# EAGLE design SwitchDemoFeather (EAGLE 9.1.3)
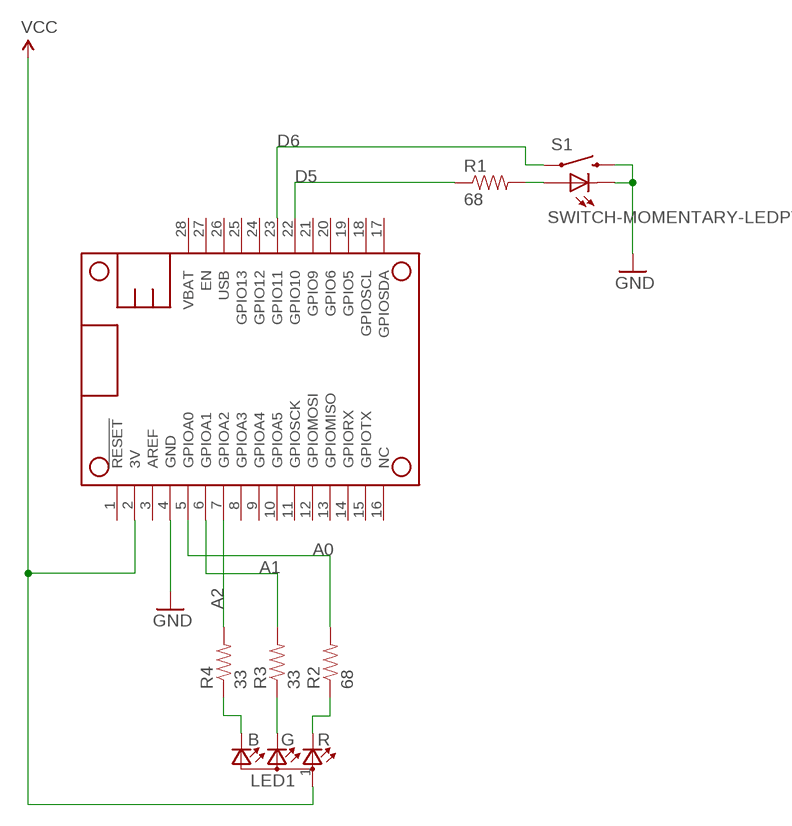
[diagram p0: schematic, sheet 1]

## Parts
LED1  LED-RGB-CREE-SMD  [LED-RGB-CREE-SMD]
MS1  FEATHERWING  [FEATHERWING]
R1  68  RES-68-0603.DEV  [0603-RES]
R2  68  RES-68-0603.DEV  [0603-RES]
R3  33  RES-33-0603.DEV  [0603-RES]
R4  33  RES-33-0603.DEV  [0603-RES]
S1  SWITCH-MOMENTARY-LEDPTH  [TACTILE-PTH-LED-12MM]

## Nets
A0: MS1.5(GPIOA0) R2.2
A1: MS1.6(GPIOA1) R3.2
A2: MS1.7(GPIOA2) R4.2
D5: MS1.22(GPIO10) R1.1
D6: MS1.23(GPIO11) S1.4
GND: MS1.4(GND) S1.2 S1.C
N$1: LED1.3(G) R3.1
N$2: LED1.2(B) R4.1
N$3: R1.2 S1.A
N$4: LED1.4(R) R2.1
VCC: LED1.1(A) MS1.2(3V)
Unconnected: MS1.1(!RESET) MS1.3(AREF) MS1.8(GPIOA3) MS1.9(GPIOA4) MS1.10(GPIOA5) MS1.11(GPIOSCK) MS1.12(GPIOMOSI) MS1.13(GPIOMISO) MS1.14(GPIORX) MS1.15(GPIOTX) MS1.16(NC) MS1.17(GPIOSDA) MS1.18(GPIOSCL) MS1.19(GPIO5) MS1.20(GPIO6) MS1.21(GPIO9) MS1.24(GPIO12) MS1.25(GPIO13) MS1.26(USB) MS1.27(EN) MS1.28(VBAT)

## Library data of the parts
LED1 = rickk2:LED-RGB-CREE-SMD: LED RGB DIFFUSED 4SMD $ 0.35 Cree CLMVB-FKA-CFHEHLCBB7A363 2mm 4-PLCC common anode RGB LED https://www.digikey.com/product-detail/en/cree-inc/CLMVB-FKA-CFHEHLCBB7A363/CLMVB-FKA-CFHEHLCBB7A363CT-ND/6138627 Red=68 ohm, Green/Blue=33 ohm @ 3.3V
MS1 = microbuilder:FEATHERWING
R1 R2 = rickk2:RES-68-0603.DEV: https://www.digikey.com/product-detail/en/panasonic-electronic-components/ERJ-3EKF68R0V/P68.0HCT-ND/1746805 Panasonic SMD 0603 1% 1/10W
R3 R4 = rickk2:RES-33-0603.DEV: https://www.digikey.com/product-detail/en/panasonic-electronic-components/ERJ-3EKF33R0V/P33.0HCT-ND/1746765 Panasonic SMD 0603 1% 1/10W
S1 = SparkFun-Electromechanical:SWITCH-MOMENTARY-LED: EZ is for Kits. There is no tStop (covering up the top side of the pads with mask). This helps the beginner see which side they should be soldering too.

## Board
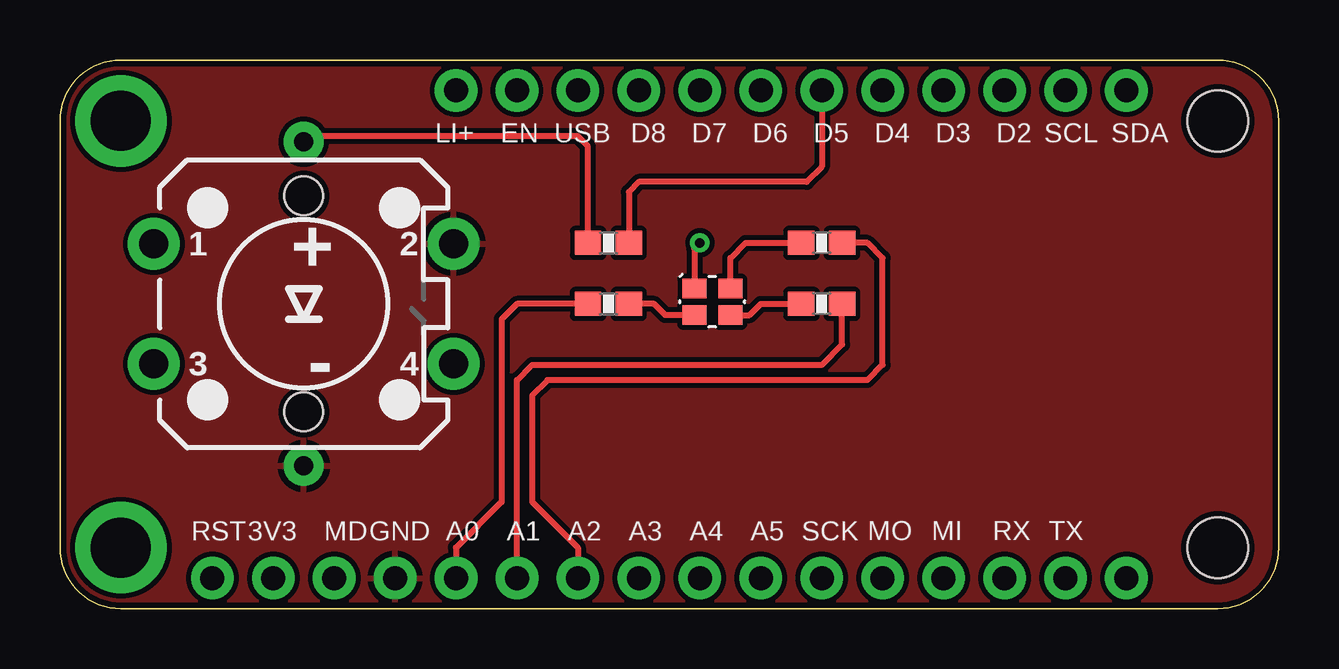
[diagram p1: board, top side]
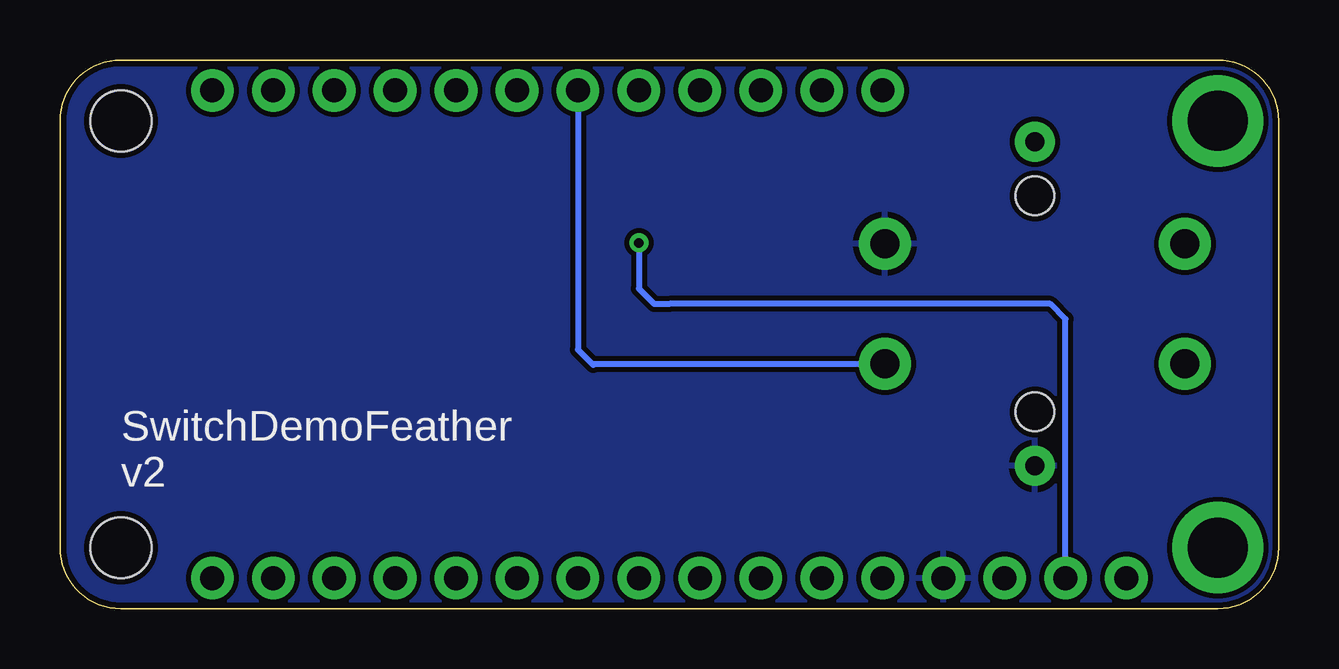
[diagram p2: board, bottom side, seen from below]

Size 50.8 x 22.86 mm. Coordinates in mm from the lower left corner, seen from the top.
Outline: 2.54,22.86 48.26,22.86 arc-90 50.8,20.32 50.8,2.54 arc-90 48.26,0 2.54,0 arc-90 0,2.54 0,20.32 arc-90 2.54,22.86
Copper layers (1*16): Top 0.035mm / dielectric 1.5mm / Bottom 0.035mm
Design rules "adafruit": minimum track width 8mil, minimum drill 15.5mil, track to track 8mil, track to pad 8mil, pad to pad 8mil, via to via 8mil, smd to smd 8mil, copper to edge 10mil, drill to drill 8mil, minimum pad ring 10mil, minimum via ring 8mil, stop-mask expansion 2mil, vias tented up to drill 20mil, thermal gap 10mil

### Footprints (pad centres in the part's own frame; a part is rotated, then mirrored left to right if it is on the bottom)
LED-RGB-CREE-SMD = smd 1 x 0.8: 1 1.5,0; 2 0,0; 3 0,1.1; 4 1.5,1.1
FEATHERWING = drill 1 pad 1.778: 1 6.35,1.27; 2 8.89,1.27; 3 11.43,1.27; 4 13.97,1.27; 5 16.51,1.27; 6 19.05,1.27; 7 21.59,1.27; 8 24.13,1.27; 9 26.67,1.27; 10 29.21,1.27; 11 31.75,1.27; 12 34.29,1.27; 13 36.83,1.27; 14 39.37,1.27; 15 41.91,1.27; 16 44.45,1.27; 17 44.45,21.59; 18 41.91,21.59; 19 39.37,21.59; 20 36.83,21.59; 21 34.29,21.59; 22 31.75,21.59; 23 29.21,21.59; 24 26.67,21.59; 25 24.13,21.59; 26 21.59,21.59; 27 19.05,21.59; 28 16.51,21.59 | drill 2.5 pad 3.81: P$1 2.54,20.32; P$2 2.54,2.54 | hole 2.54: 48.26,20.32; 48.26,2.54
0603-RES = smd 1.1 x 1: 1 -0.85,0; 2 0.85,0
TACTILE-PTH-LED-12MM = drill 1.2 pad 2.159: 1 -6.25,2.5; 2 6.25,2.5; 3 -6.25,-2.5; 4 6.25,-2.5 | drill 0.8 pad 1.676: A 0,6.75; C 0,-6.75 | hole 1.6: 0,4.5; 0,-4.5

### Placement (x,y rotation side)
LED1  27.94,13.34 180 top
MS1  0,0 0 top
R1  22.86,15.24 180 top
R2  22.86,12.7 180 top
R3  31.75,12.7 0 top
R4  31.75,15.24 0 top
S1  10.16,12.7 0 top

### Tracks (layer width: path | path; a pad name or v marks a point on that pad's centre or on a via)
A0
  Top 0.254: R2.2 19.05,12.7 18.41,12.06 18.41,4.45 16.51,2.54 MS1.5
A1
  Top 0.254: MS1.6 19.05,9.53 19.68,10.16 31.75,10.16 32.6,11.01 R3.2
A2
  Top 0.254: R4.2 33.66,15.24 34.29,14.61 34.29,10.16 33.66,9.53 20.32,9.53 19.68,8.89 19.68,4.45 21.59,2.54 MS1.7
D5
  Top 0.254: MS1.22 31.75,18.41 31.11,17.78 24.13,17.78 23.71,17.36 R1.1
D6
  Bottom 0.254: MS1.23 29.21,10.79 28.57,10.16 28.54,10.2 S1.4
GND
  pour Top: 0,0 0,22.86 50.8,22.86 50.8,0
  pour Bottom: 0,0 0,22.86 50.8,22.86 50.8,0
N$1
  Top 0.254: LED1.3 28.75,12.23 29.21,12.7 R3.1
N$2
  Top 0.254: LED1.2 27.94,14.61 28.57,15.24 R4.1
N$3
  Top 0.254: R1.2 22.01,19.27 21.59,19.68 10.39,19.68 S1.A
N$4
  Top 0.254: LED1.4 25.23,12.23 24.77,12.7 R2.1
VCC  (via drill 0.39)
  Top 0.254: v26.67,15.24 26.44,15.01 LED1.1
  Bottom 0.254: MS1.2 8.89,12.06 9.53,12.7 25.4,12.7 26.04,12.7 26.67,13.34 v26.67,15.24

### Text on the board
tPlace: LI+ | EN | USB | D8 | D7 | D6 | D5 | D4 | D3 | D2 | SCL | SDA | RST | 3V3 | MD | GND | A0 | A1 | A2 | A3 | A4 | A5 | SCK | MO | MI | RX | TX
bPlace: SwitchDemoFeather / v2